# EAGLE design MaxAir_Smart_Home_Gateway_WT21-ET01-v095 (EAGLE 9.6.2)
MaxAir - Smart Heating, Ventilation and Air Conditioning (HVAC) Wi-Fi Smart Home Gateway based on MySensors library WT21ETH01 and nRF24L01 PA LNA Note: Power supplied by Barrel Jack connector with minimum 2amp for better performance. For more information on PiHome Smart Heating: http://www.pihome.eu
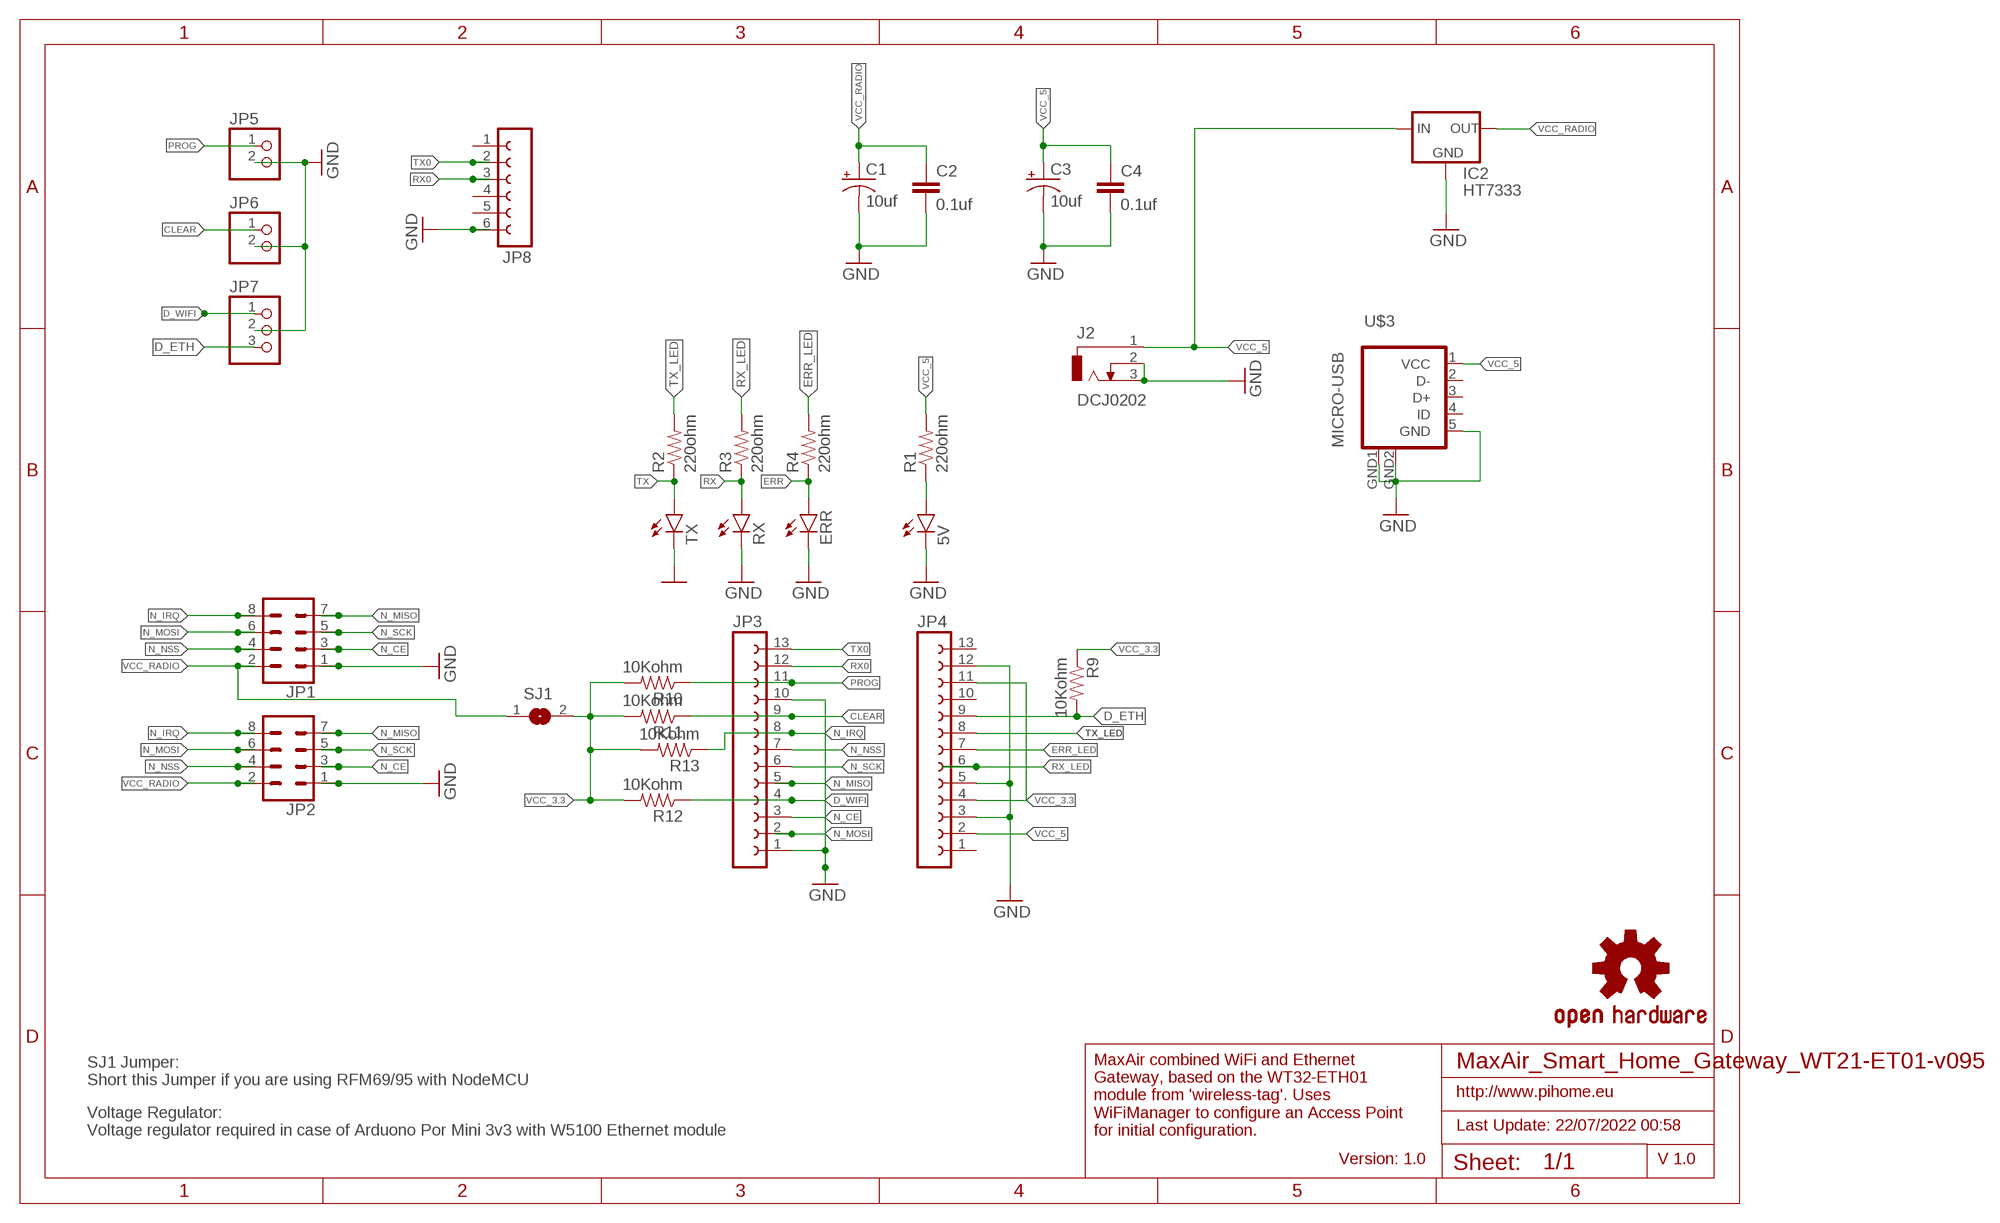
[diagram p0: schematic, sheet 1]

## Parts
5V  LED3MM  [LED3MM]
C1  10uf  10UF-25V-20%(PTH)KIT  [CPOL-RADIAL-10UF-25V-KIT]
C2  0.1uf  0.1UF-50V-20%(PTH)KIT-EZ  [CAP-PTH-SMALL-KIT]
C3  10uf  10UF-25V-20%(PTH)KIT  [CPOL-RADIAL-10UF-25V-KIT]
C4  0.1uf  0.1UF-50V-20%(PTH)KIT-EZ  [CAP-PTH-SMALL-KIT]
ERR  LED3MM  [LED3MM]
IC2  HT7333  [SOT-89]
J2  DCJ0202  [DCJ0202]
JP1  CONN_04X2  [2X4]
JP2  CONN_04X2  [2X4]
JP3  FE13-1  [FE13]
JP4  FE13-1  [FE13]
JP5  PINHD-1X2  [1X02]
JP6  PINHD-1X2  [1X02]
JP7  PINHD-1X3  [1X03]
JP8  FE06-1  [FE06]
LOGO1  OSHW-LOGOMINI  [OSHW-LOGO-MINI]
R1  220ohm  RESISTORAXIAL-0.3  [AXIAL-0.3]
R2  220ohm  RESISTORAXIAL-0.3  [AXIAL-0.3]
R3  220ohm  RESISTORAXIAL-0.3  [AXIAL-0.3]
R4  220ohm  RESISTORAXIAL-0.3  [AXIAL-0.3]
R9  10Kohm  RESISTORAXIAL-0.3  [AXIAL-0.3]
R10  10Kohm  RESISTORAXIAL-0.3  [AXIAL-0.3]
R11  10Kohm  RESISTORAXIAL-0.3  [AXIAL-0.3]
R12  10Kohm  RESISTORAXIAL-0.3  [AXIAL-0.3]
R13  10Kohm  RESISTORAXIAL-0.3  [AXIAL-0.3]
RX  LED3MM  [LED3MM]
SJ1  SJ  [SJ]
TX  LED3MM  [LED3MM]
U$3  MICRO-USB  [MICRO-USB]

## Nets
CLEAR: JP3.9 JP6.1 R11.P$1
D_ETH: JP4.9 JP7.3 R9.P$2
D_WIFI: JP3.4 JP7.1 R12.P$1
ERR: ERR.A R4.P$1
ERR_LED: JP4.7 R4.P$2
GND: 5V.K(C) C1.2(-) C2.2 C3.2(-) C4.2 ERR.K(C) IC2.2(GND) J2.2 J2.3 JP1.1 JP2.1 JP3.1 JP3.10 JP4.3 JP4.5 JP4.12 JP5.2 JP6.2 JP7.2 JP8.6 RX.K(C) TX.K(C) U$3.5(GND) U$3.GND1(GND) U$3.GND2(GND)
N$1: 5V.A R1.P$1
N_CE: JP1.3 JP2.3 JP3.3
N_IRQ: JP1.8 JP2.8 JP3.8 R13.P$1
N_MISO: JP1.7 JP2.7 JP3.5
N_MOSI: JP1.6 JP2.6 JP3.2
N_NSS: JP1.4 JP2.4 JP3.7
N_SCK: JP1.5 JP2.5 JP3.6
PROG: JP3.11 JP5.1 R10.P$1
RX: R3.P$1 RX.A
RX0: JP3.12 JP8.3
RX_LED: JP4.6 R3.P$2
TX: R2.P$1 TX.A
TX0: JP3.13 JP8.2
TX_LED: JP4.8 R2.P$2
VCC_3.3: JP4.4 JP4.11 R9.P$1 R10.P$2 R11.P$2 R12.P$2 R13.P$2 SJ1.2
VCC_5: C3.1(+) C4.1 IC2.3(IN) IC2.4(IN) J2.1 JP4.2 R1.P$2 U$3.1(VCC)
VCC_RADIO: C1.1(+) C2.1 IC2.1(OUT) JP1.2 JP2.2 SJ1.1
Unconnected: JP4.1 JP4.10 JP4.13 JP8.1 JP8.4 JP8.5 U$3.2(D-) U$3.3(D+) U$3.4(ID)

## Notes on the sheet
- SJ1 Jumper:
  Short this Jumper if you are using RFM69/95 with NodeMCU
- http://www.pihome.eu
- Last Update: 22/07/2022 00:58
- Voltage Regulator:
  Voltage regulator required in case of Arduono Por Mini 3v3 with W5100 Ethernet module
- MaxAir combined WiFi and Ethernet
  Gateway, based on the WT32-ETH01
  module from 'wireless-tag'. Uses
  WiFiManager to configure an Access Point
  for initial configuration.
- Version: 1.0 | V 1.0

## Library data of the parts
5V ERR RX TX = SparkFun-LED:LED: LEDs Standard schematic elements and footprints for 5mm, 3mm, 1206, and 0603 sized LEDs. 5mm - Spark Fun Electronics SKU : COM-00529 (and others); PROD_ID: DIO-08794
C1 C3 = SparkFun-Capacitors:10UF-25V-20%(PTH): CAP-08440; PROD_ID: CAP-08440
C2 C4 = SparkFun-Capacitors:0.1UF-50V-20%(PTH): CAP-08370; PROD_ID: CAP-08370
IC2 = holtek2:HT73*
J2 = con-jack:DCJ0202: DC POWER JACK Source: DCJ0202.pdf; OC_FARNELL: unknown; OC_NEWARK: unknown
JP1 JP2 = SparkFun-Connectors:CONN_04X2: Multi connection point. Often used as Generic Header-pin footprint for 0.1 inch spaced/style header connections On any of the 0.1 inch spaced packages, you can populate with these: Break Away Headers - Straight <https://www.sparkfun.com/products/116> (PRT-00116) Break Away Male Headers - Right Angle <https://www.sparkfun.com/products/553> (PRT-00553) Female Headers <https://www.sparkfun.com/products/115> (PRT-00115) Break Away Headers - Machine Pin <https://www.sparkfun.com/products/117> (PRT-00117) Break Away Female Headers - Swiss Machine Pin <https://www.sparkfun.com/products/743> (PRT-00743)
JP3 JP4 = con-lsta:FE13-1: FEMALE HEADER; OC_FARNELL: unknown; OC_NEWARK: unknown
JP5 JP6 = pinhead:PINHD-1X2: PIN HEADER
JP7 = pinhead:PINHD-1X3: PIN HEADER
JP8 = con-lsta:FE06-1: FEMALE HEADER; OC_FARNELL: unknown; OC_NEWARK: unknown
LOGO1 = SparkFun-Aesthetics@1:OSHW-LOGO: Open-Source Hardware (OSHW) Logo This logo indicates the piece of hardware it is found on incorporates a OSHW license and/or adheres to the definition of open source hardware found here: http://freedomdefined.org/OSHW
R1-R4 R9-R13 = SparkFun-Passives:RESISTOR: Resistor Basic schematic elements and footprints for 0603, 1206, and PTH resistors.
SJ1 = jumper:SJ: SMD solder JUMPER
U$3 = microusb:MICRO-USB: Micro USB B connector

## Net classes
0 default: width 0.254 mm, drill 0.076 mm, clearance 0.205 mm

## Board
MaxAir - Smart Heating, Ventilation and Air Conditioning (HVAC) Wi-Fi Smart Home Gateway based on MySensors library WT21ETH01 and nRF24L01 PA LNA Note: Power supplied by Barrel Jack connector with minimum 2amp for better performance. For more information on PiHome Smart Heating: http://www.pihome.eu
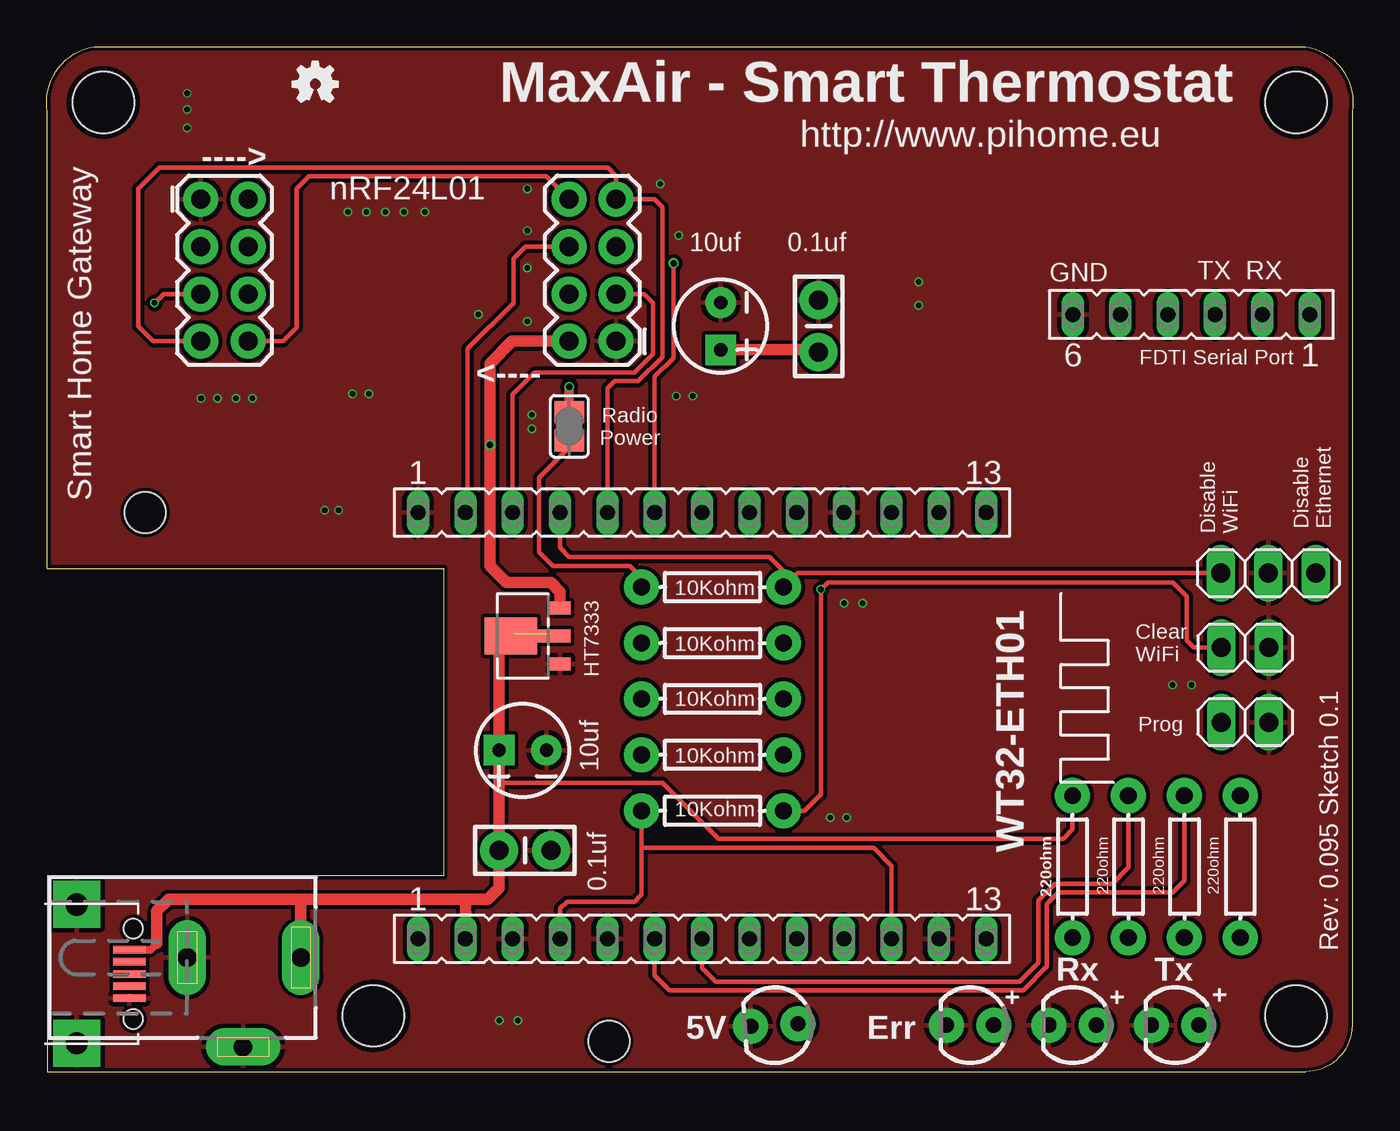
[diagram p1: board, top side]
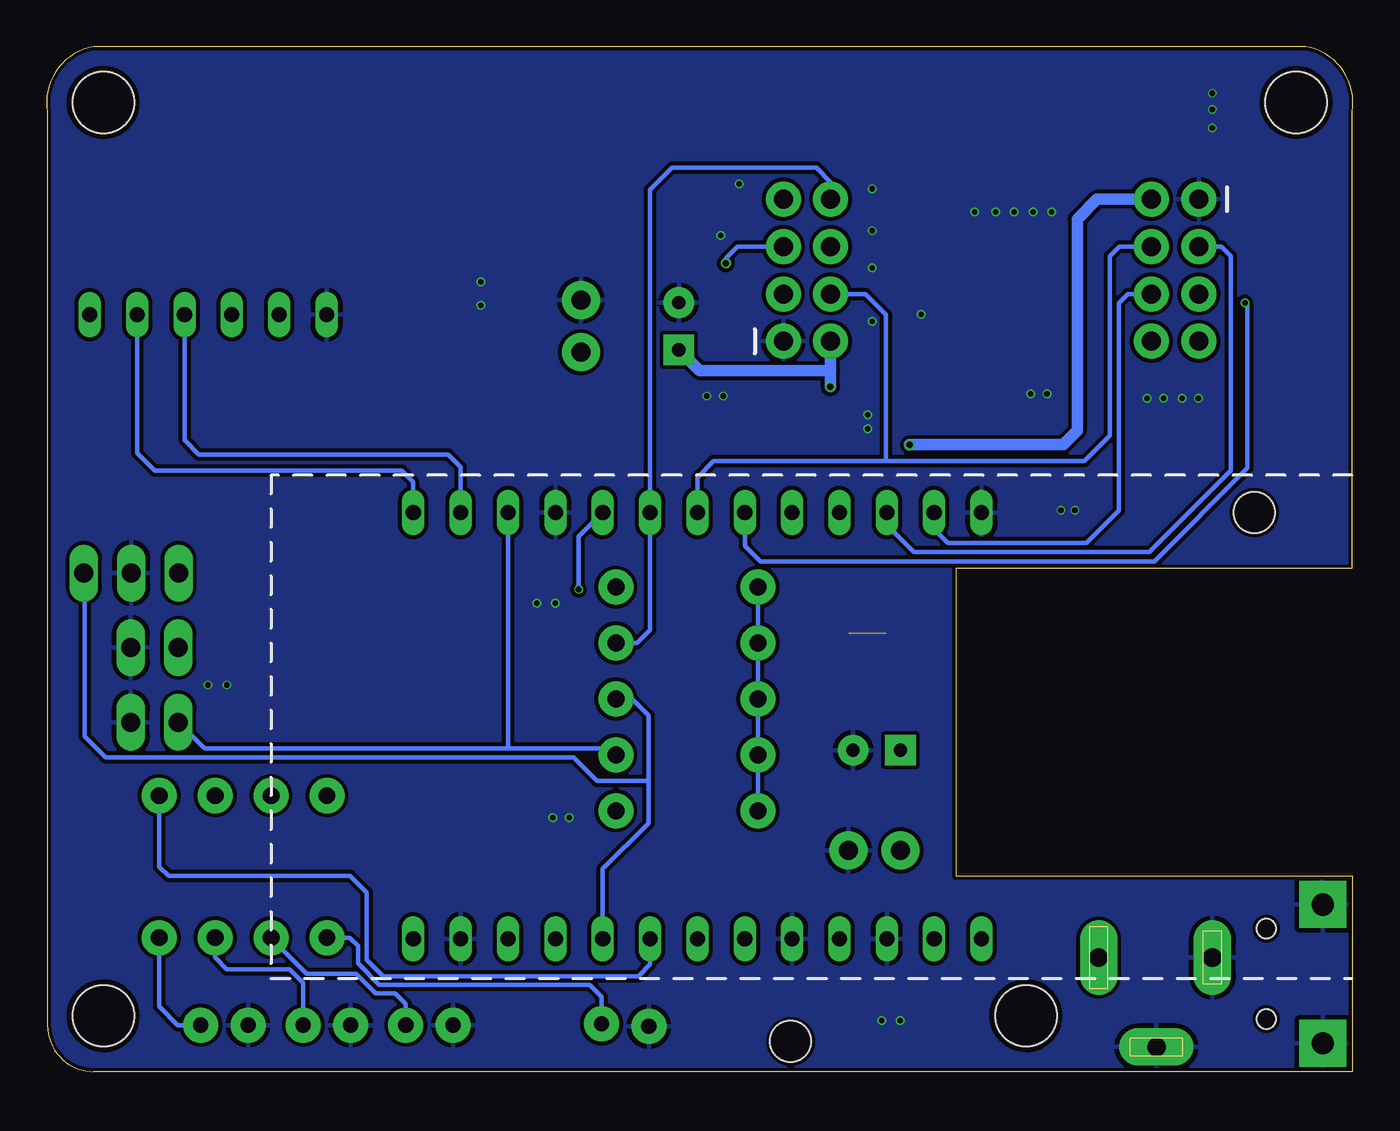
[diagram p2: board, bottom side, seen from below]

Size 70.08 x 55 mm. Coordinates in mm from the lower left corner, seen from the top.
Outline: 0.04,0 67.54,0 arc90 70.04,2.5 70.04,51.5 arc90 67.54,55 2.54,55 arc90 0.04,51.5 0.04,27 21.29,27 21.29,10.5 0.04,10.5 0.04,0
Copper layers (1*16): Top 0.035559375mm / dielectric 1.6mm / Bottom 0.035559375mm
Design rules "PiHome - JLCPCB 2 Layer": minimum track width 5mil, minimum drill 12mil, track to track 5mil, track to pad 5mil, pad to pad 5mil, via to via 5mil, smd to smd 5mil, copper to edge 8mil, drill to drill 6mil, minimum pad ring 5mil, minimum via ring 3mil, stop-mask expansion 2.5mil, vias tented up to drill 0mil, thermal gap 10mil
Holes 2.2 mm at 5.29,30 30.17,1.62

### Footprints (pad centres in the part's own frame; a part is rotated, then mirrored left to right if it is on the bottom)
LED3MM = drill 0.813 pad 1.88: A -1.27,0; K 1.27,0
CPOL-RADIAL-10UF-25V-KIT = drill 0.7 pad 1.651 square: 1 1.27,0 | drill 0.7 pad 1.651: 2 -1.27,0
CAP-PTH-SMALL-KIT = drill 1.016 pad 2.032: 1 -1.397,0; 2 1.397,0
SOT-89 = smd 0.7 x 1.1: 1 1.5,-2.385; 2 -1.5,-2.385 | smd 0.7 x 1.8: 3 0,-2.035 | smd 2 x 2.8: 4 0,0.265
DCJ0202 = drill 1 pad 2 long: 1 0,3.1; 2 4.8,0; 3 0,-3
2X4 = drill 1.016 pad 1.88: 1 -3.81,-1.27; 2 -3.81,1.27; 3 -1.27,-1.27; 4 -1.27,1.27; 5 1.27,-1.27; 6 1.27,1.27; 7 3.81,-1.27; 8 3.81,1.27
FE13 = drill 0.813 long: 1 -15.24,0; 2 -12.7,0; 3 -10.16,0; 4 -7.62,0; 5 -5.08,0; 6 -2.54,0; 7 0,0; 8 2.54,0; 9 5.08,0; 10 7.62,0; 11 10.16,0; 12 12.7,0; 13 15.24,0
1X02 = drill 1.016 long: 1 -1.27,0; 2 1.27,0
1X03 = drill 1.016 long: 1 -2.54,0; 2 0,0; 3 2.54,0
FE06 = drill 0.813 long: 1 -6.35,0; 2 -3.81,0; 3 -1.27,0; 4 1.27,0; 5 3.81,0; 6 6.35,0
AXIAL-0.3 = drill 0.9 pad 1.88: P$1 -3.81,0; P$2 3.81,0
SJ = smd 1.168 x 1.6: 1 -0.762,0; 2 0.762,0
STAND-OFF = hole 3.302: 0,0
MICRO-USB = smd 0.4 x 1.75: 1 -1.3,4.525; 2 -0.65,4.525; 3 0,4.525; 4 0.65,4.525; 5 1.3,4.525 | drill 1.2 pad 2.54 square: GND1 -3.725,1.7; GND2 3.725,1.7 | hole 1.05: -2.425,4.73; 2.425,4.73

### Placement (x,y rotation side)
5V  39.04,2.5 183.3 top
C1  36.17,40 270 top
C2  41.42,40 90 top
C3  25.54,17.25 180 top
C4  25.67,11.88 0 top
ERR  49.54,2.5 180 top
IC2  25.17,23.38 90 top
J2  10.54,6.12 270 top
JP1  29.29,43 90 top
JP2  9.54,43 270 top
JP3  35.17,30 0 top
JP4  35.17,7.12 0 top
JP5  64.29,18.75 0 top
JP6  64.29,22.75 0 top
JP7  65.54,26.75 0 top
JP8  61.42,40.62 180 top
LOGO1  14.42,53 0 top
R1  55.04,11 90 top
R2  64.04,11 90 top
R3  61.04,11 90 top
R4  58.04,11 90 top
R9  35.73,20 0 top
R10  35.73,17 180 top
R11  35.73,14 180 top
R12  35.73,26 180 top
R13  35.73,23 180 top
RX  55.04,2.5 180 top
SJ1  28.04,34.62 270 top
TX  60.54,2.5 180 top
U$1  [STAND-OFF]  3.04,52 0 top
U$2  [STAND-OFF]  17.54,3 0 top
U$3  -0.08,5.25 270 top
U$4  [STAND-OFF]  67.04,52 0 top
U$5  [STAND-OFF]  67.04,3 0 top

### Tracks (layer width: path | path; a pad name or v marks a point on that pad's centre or on a via)
CLEAR  (via drill 0.3)
  Top 0.254: R11.P$1 40.67,14 41.54,14.88 v41.54,25.88 41.92,26.25 60.42,26.25 61.17,25.5 61.17,23.12 61.54,22.75 JP6.1
  Bottom 0.254: JP3.9 41.54,28.7 v41.54,25.88
D_ETH
  Bottom 0.254: JP7.3 68.04,26.5 68.04,18 66.92,16.88 41.81,16.88 40.54,15.6 37.81,15.6 37.79,15.62 | JP4.9 40.25,10.88 37.79,13.33 37.79,15.62 | 37.79,15.62 37.79,19.13 38.66,20 R9.P$2
D_WIFI
  Top 0.254: JP3.4 27.55,28.12 28.04,27.62 38.79,27.62 39.54,26.88 R12.P$1 40.29,26.75 JP7.1
ERR
  Bottom 0.254: R4.P$1 58.04,7.15 56.14,5.25 53.46,5.25 52.42,4.21 51.37,4.21 50.81,3.65 ERR.A
ERR_LED
  Top 0.254: JP4.7 35.17,5.58 35.92,4.83 52.2,4.83 53.21,5.84 53.21,9.19 54.1,10.08 57.17,10.08 58.04,10.96 R4.P$2
GND  (via drill 0.3)
  other vias: 8.29,36.12 9.17,36.12 10.17,36.12 11.04,36.12 16.42,36.38 17.29,36.38 26.04,34.5 26.04,35.25 14.92,30.12 15.67,30.12 7.54,52.5 7.54,51.62 7.54,50.62 42.79,25.12 43.79,25.12 42.04,13.62 42.92,13.62 61.42,20.75 60.42,20.75 46.79,42.38 46.79,41.12 16.17,46.12 17.17,46.12 18.17,46.12 19.17,46.12 20.29,46.12 33.79,36.25 34.67,36.25 24.29,2.75 25.29,2.75 25.79,40.25 25.79,43.12 23.17,40.62 25.79,45.12 25.79,47.38 32.92,47.62 33.92,44.88
  pour Top: 0.29,0.25 0.29,10.25 21.54,10.25 21.54,27.25 0.29,27.25 0.29,54.75 69.79,54.75 69.79,0.25
  pour Bottom: 0.29,0.25 69.79,0.25 69.79,54.75 0.29,54.75 0.29,27.25 21.54,27.25 21.54,10.25 0.29,10.25
N$1
  Bottom 0.254: 5V.A 40.31,4.02 40.96,4.67 52.23,4.67 53.37,5.81 53.37,6.75 53.81,7.19 R1.P$1
N_CE
  Top 0.254: JP3.3 25.01,36.34 26.17,37.5 31.54,37.5 32.54,38.5 32.54,41.25 32.06,41.73 JP1.3
  Bottom 0.254: JP2.3 7.06,44.27 6.54,43.75 6.54,32.25 10.92,27.88 23.54,27.88 25.01,29.34 JP3.3
N_IRQ
  Top 0.254: JP2.8 12.69,39.19 13.42,39.92 13.42,47.38 14.08,48.04 26.79,48.04 JP1.8
  Bottom 0.254: JP1.8 28.02,47.73 28.79,48.5 36.54,48.5 37.71,47.34 JP3.8 37.71,23.71 38.41,23 R13.P$1
N_MISO
  Top 0.254: JP3.5 30.09,36.67 30.46,37.04 31.73,37.04 33.04,38.35 33.04,46.38 32.61,46.81 JP1.7 30.56,48.06 30.12,48.5 6.04,48.5 4.92,47.38 4.92,40 5.73,39.19 JP2.7
N_MOSI
  Top 0.254: 22.54,30 JP3.2 22.59,30.12 22.59,38.8 25.04,41.25 25.04,43.62 25.69,44.27 JP1.6
  Bottom 0.254: JP2.6 12.06,41.73 12.56,41.23 12.56,30.11 14.29,28.38 21.72,28.38 22.47,29.12 JP3.2
N_NSS
  Bottom 0.254: JP3.7 35.17,31.88 34.29,32.75 25.04,32.75 | 25.04,32.75 25.04,40.62 26.15,41.73 JP1.4 | JP2.4 12.52,44.27 13.04,43.75 13.04,34.12 14.42,32.75 25.04,32.75
N_SCK  (via drill 0.3, 0.35)
  Top 0.254: JP2.5 6.27,41.73 v5.79,41.25 | JP3.6 32.63,37.29 33.62,38.29 v33.62,43.38 v33.63,43.38
  Bottom 0.254: v5.79,41.25 5.67,41.12 5.67,32.38 10.67,27.38 31.79,27.38 32.63,28.21 JP3.6 | JP1.5 33.02,44.27 33.63,43.66 v33.63,43.38
PROG
  Bottom 0.254: JP5.1 61.6,17.33 45.29,17.33 | 45.29,17.33 39.87,17.33 R10.P$1 | 45.29,17.33 45.33,17.37 JP3.11
RX
  Bottom 0.254: R3.P$1 61.04,6.12 60.42,5.5 57.04,5.5 56.31,4.77 RX.A
RX0
  Bottom 0.254: JP3.12 47.87,32.45 48.54,33.12 61.92,33.12 62.69,33.9 JP8.3
RX_LED
  Top 0.254: JP4.6 32.63,5.17 33.42,4.38 52.39,4.38 53.67,5.65 53.67,9 54.29,9.62 60.42,9.62 61.04,10.25 R3.P$2
TX
  Bottom 0.254: R2.P$1 64.04,3.5 63.04,2.5 TX.A
TX0
  Bottom 0.254: JP3.13 50.41,31.62 51.03,32.25 64.29,32.25 65.23,33.19 JP8.2
TX_LED
  Bottom 0.254: JP4.8 37.71,5.75 38.33,5.12 52.04,5.12 52.92,6 52.92,9.62 53.79,10.5 63.54,10.5 64.04,11 R2.P$2
VCC_3.3
  Top 0.254: SJ1.2 28.04,33.5 26.42,31.88 26.42,27.88 27.17,27.12 31.29,27.12 31.92,26.5 R12.P$2 32.04,26 | 31.92,12 44.38,12 45.33,11.05 JP4.11 | 31.92,12 R11.P$2 | JP4.4 27.55,8.76 27.92,9.12 31.54,9.12 31.92,9.5 31.92,12
  Bottom 0.254: R11.P$2 R10.P$2 R9.P$1 R13.P$2 R12.P$2
VCC_5  (1 unrouted)
  Top 0.254: 27.04,23.5 IC2.3 | 25.04,23.5 IC2.4 | R1.P$2 55.04,13 54.54,12.5 36.04,12.5 33.04,15.5 24.27,15.5
  Top 0.406: U$3.1 5.59,6.55 5.92,6.88
  Top 0.61: IC2.4 24.28,22.75 C3.1 24.27,15.5 C4.1 24.27,9.85 23.67,9.25 22.42,9.25 | 5.92,6.88 5.92,8.62 6.54,9.25 13.67,9.25 | 13.67,9.25 22.42,9.25 | JP4.2 22.47,9.2 22.42,9.25 | J2.1 13.64,9.22 13.67,9.25
VCC_RADIO  (via drill 0.35)
  Top 0.254: 27.54,25 IC2.1 | SJ1.1 28.04,35.5
  Top 0.508: v28.04,36.75 SJ1.1
  Top 0.61: IC2.1 27.55,25.75 27.05,26.25 24.67,26.25 23.79,27.12 v23.79,33.62 23.79,38 24.98,39.19 JP1.2 | C1.1 41.29,38.73 C2.1
  Bottom 0.61: JP2.2 13.73,46.81 14.79,45.75 14.79,34.39 15.54,33.64 23.78,33.64 v23.79,33.62 | v28.04,36.75 28.02,36.77 28.02,37.62 | 28.02,37.62 JP1.2 | C1.1 35.06,37.62 28.02,37.62

### Text on the board
tPlace: MaxAir - Smart Thermostat | http://www.pihome.eu | Smart Home Gateway | ----> | nRF24L01 | 0.1uf | TX | RX | <---- | Radio / Power | Disable / WiFi | Disable / Ethernet | Clear / WiFi | Prog | WT32-ETH01 | 0.1uf | Rev: 0.095 Sketch 0.1 | Rx | Tx | + | + | + | 5V | Err
tNames: GND | FDTI Serial Port